# Altium schematic sheet empty.SchDoc
size 297 x 209 mm
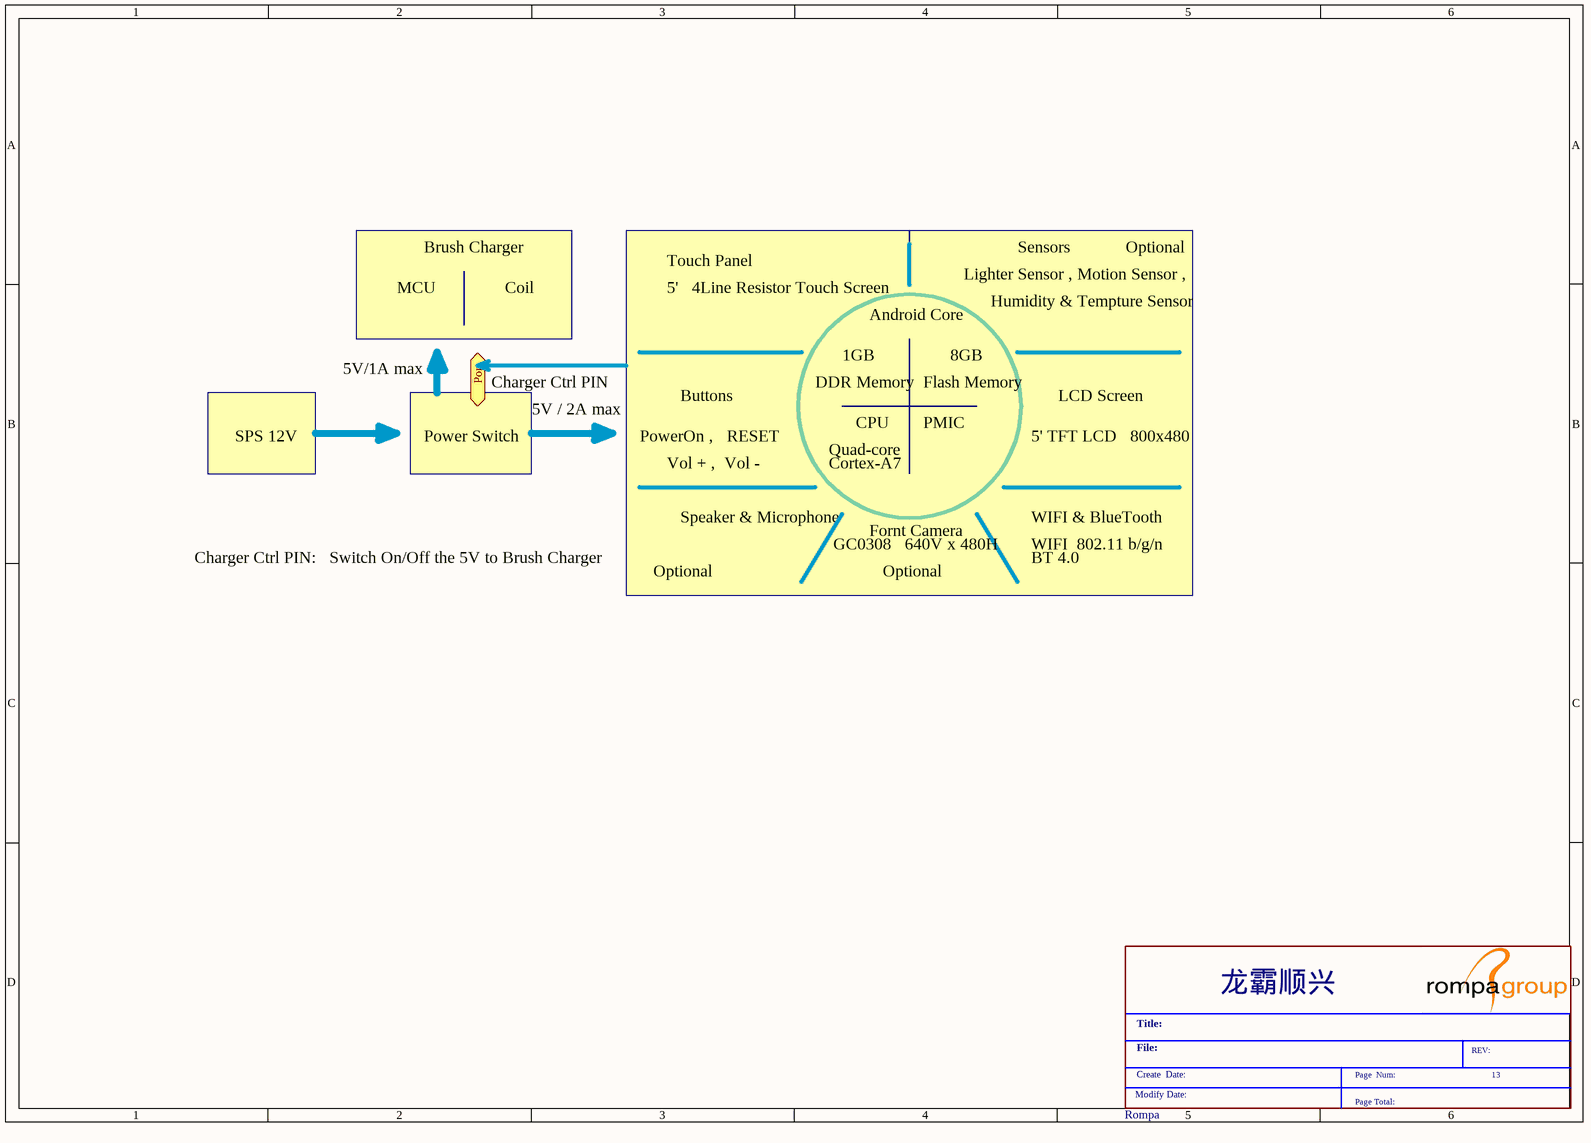
[diagram p0: empty.SchDoc]

## Parts
*  Rompa  Schematic Page Number: 13  (graphical)

## Ports
Port

## Notes on the sheet
- Brush Charger
- Touch Panel
- Sensors
- Optional
- MCU
- Coil
- 5'   4Line Resistor Touch Screen
- Android Core
- Lighter Sensor , Motion Sensor ,
- Humidity & Tempture Sensor
- 5V/1A max
- Charger Ctrl PIN
- Buttons
- DDR Memory
- 1GB
- Flash Memory
- 8GB
- LCD Screen
- SPS 12V
- Power Switch
- 5V / 2A max
- PowerOn ,   RESET
- Vol + ,  Vol -
- Quad-core
- Cortex-A7
- CPU
- PMIC
- 5' TFT LCD   800x480
- Speaker & Microphone
- Fornt Camera
- WIFI & BlueTooth
- Charger Ctrl PIN:   Switch On/Off the 5V to Brush Charger
- GC0308   640V x 480H
- WIFI  802.11 b/g/n
- BT 4.0
- (in symbol Rompa) 龙霸顺兴; Title:; File:; REV:; Create  Date:; Page  Num:; Modify Date:; Page Total: